# Altium project eLFLv2_0.PrjPcb
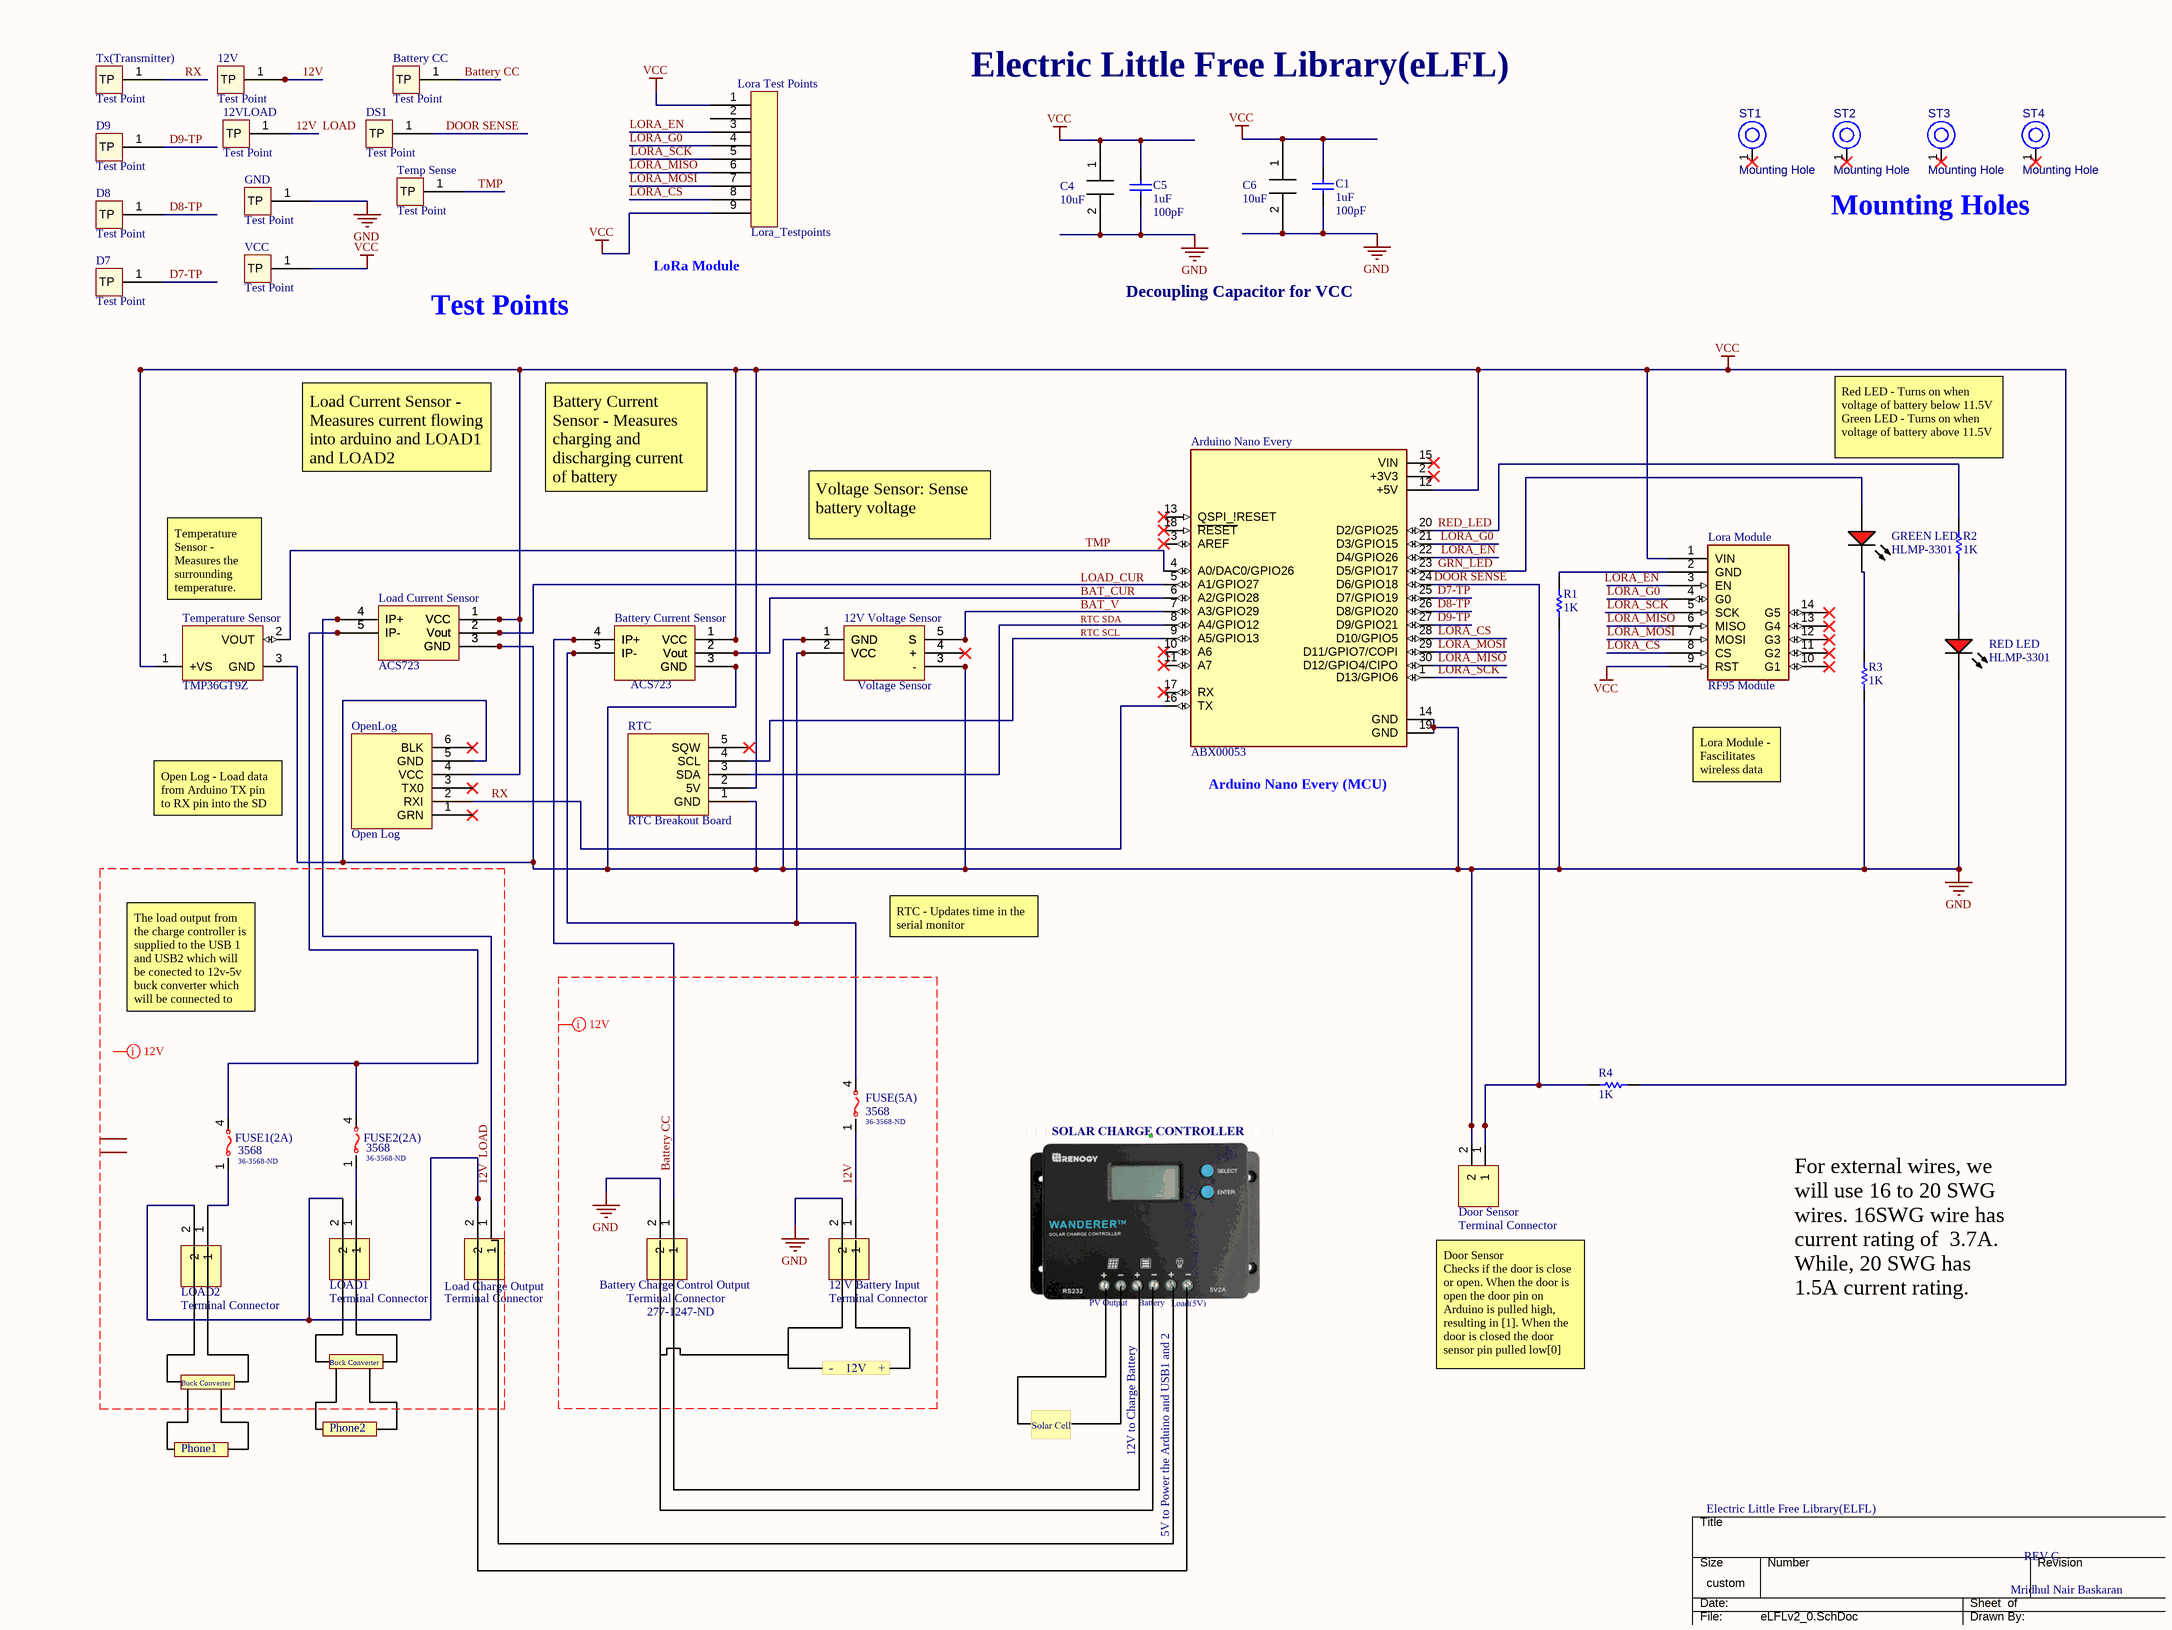
[diagram p0: eLFLv2_0.SchDoc]
1 sheet, 43 parts. Net scope: global (net labels, ports and power ports of the same name join across sheets).
Board file: eLFLv2_0.PcbDoc

## Sheet eLFLv2_0.SchDoc: ELFL REV C
size 406 x 304 mm; ApprovedBy: Professor Giri Venkataramanan; Author: Mridhul Nair; CompanyName: WEMPEC; DrawnBy: Mridhul Nair; Engineer: Mridhul Nair; Address1: mbaskaran@wisc.edu; Revision: B; SheetNumber: 1; SheetTotal: 1

### Parts
12_V_Battery_Input  Terminal Connector  [Terminal Block]
12V  Test Point  [TP1]  (no BOM)
12V_Voltage_Sensor  Voltage Sensor  [Voltage Sensor]
12VLOAD  Test Point  [TP1]  (no BOM)
Arduino_Nano_Every  ABX00053  [Arduino Nano Every]
Battery_CC  Test Point  [TP1]  (no BOM)
Battery_Charge_Control_Output  Terminal Connector  Supplier Part Number 1: 277-1247-ND  [Terminal Block]
Battery_Current_Sensor  ACS723  [Current Sensor]
C1  1uF  value 100pF  [RAD-0.3]
C4  10uF  [Capacitor]
C5  1uF  value 100pF  [RAD-0.3]
C6  10uF  [Capacitor]
D7  Test Point  [0.038_Brass Testpoints]  (no BOM)
D8  Test Point  [0.038_Brass Testpoints]  (no BOM)
D9  Test Point  [0.038_Brass Testpoints]  (no BOM)
Door_Sensor  Terminal Connector  [Terminal Block]
DS1  Test Point  [TP1]  (no BOM)
FUSE1(2A)  3568  Supplier Part Number 1: 36-3568-ND  [Fuse]
FUSE2(2A)  3568  Supplier Part Number 1: 36-3568-ND  [Fuse]
FUSE(5A)  3568  Supplier Part Number 1: 36-3568-ND  [Fuse]
GND  Test Point  [0.038_Brass Testpoints]  (no BOM)
GREEN_LED  HLMP-3301  [LED]
LOAD1  Terminal Connector  [Terminal Block]
LOAD2  Terminal Connector  [Terminal Block]
Load_Charge_Output  Terminal Connector  [Terminal Block]
Load_Current_Sensor  ACS723  [Current Sensor]
Lora_Module  RF95 Module  [RF95]
Lora_Test_Points  Lora_Testpoints  [LORA TESTPOINTS]
OpenLog  Open Log  [OpenLog Breakout Board]
R1  value 1K  [AXIAL-0.3]  (hidden comment: Res1)
R2  value 1K  [AXIAL-0.3]  (hidden comment: Res1)
R3  value 1K  [AXIAL-0.3]  (hidden comment: Res1)
R4  value 1K  [AXIAL-0.3]  (hidden comment: Res1)
RED_LED  HLMP-3301  [LED]
RTC  RTC Breakout Board  [RTC Breakout Board]
ST1  Mounting Hole  [PTH-M2D5X5]
ST2  Mounting Hole  [PTH-M2D5X5]
ST3  Mounting Hole  [PTH-M2D5X5]
ST4  Mounting Hole  [PTH-M2D5X5]
Temp_Sense  Test Point  [TP1]  (no BOM)
Temperature_Sensor  TMP36GT9Z  [HDR1X3]
Tx(Transmitter)  Test Point  [TP1]  (no BOM)
VCC  Test Point  [0.038_Brass Testpoints]  (no BOM)

### Nets
GND: 12_V_Battery_Input.2 12V_Voltage_Sensor.1(GND) 12V_Voltage_Sensor.3(-) Arduino_Nano_Every.14(GND) Arduino_Nano_Every.19(GND) Battery_Charge_Control_Output.2 Battery_Current_Sensor.3(GND) C1.1 C4.2(-) C5.1 C6.2(-) Door_Sensor.2 GND.1(TP) Load_Current_Sensor.3(GND) OpenLog.5(GND) R1.2 R3.2 RED_LED.2(K) RTC.1(GND) Temperature_Sensor.3(GND)
VCC: Arduino_Nano_Every.12(+5V) Battery_Current_Sensor.1(VCC) C1.2 C4.1(+) C5.2 C6.1(+) Load_Current_Sensor.1(VCC) Lora_Module.1(VIN) Lora_Module.9(RST) Lora_Test_Points.1 Lora_Test_Points.9 OpenLog.4(VCC) R4.2 RTC.2(5V) Temperature_Sensor.1(+VS) VCC.1(TP)
12V: 12_V_Battery_Input.1 12V.1(TP) FUSE(5A).1
12V  LOAD: 12VLOAD.1(TP) Load_Charge_Output.1 Load_Current_Sensor.4(IP+)
Battery CC: Battery_CC.1(TP) Battery_Charge_Control_Output.1 Battery_Current_Sensor.4(IP+)
D7-TP: Arduino_Nano_Every.25(D7/GPIO19) D7.1(TP)
D8-TP: Arduino_Nano_Every.26(D8/GPIO20) D8.1(TP)
D9-TP: Arduino_Nano_Every.27(D9/GPIO21) D9.1(TP)
DOOR SENSE: Arduino_Nano_Every.24(D6/GPIO18) Door_Sensor.1 DS1.1(TP) R4.1
GRN_LED: Arduino_Nano_Every.23(D5/GPIO17) GREEN_LED.1(A)
LORA_CS: Arduino_Nano_Every.28(D10/GPIO5) Lora_Module.8(CS) Lora_Test_Points.8
LORA_EN: Arduino_Nano_Every.22(D4/GPIO26) Lora_Module.3(EN) Lora_Test_Points.3
LORA_G0: Arduino_Nano_Every.21(D3/GPIO15) Lora_Module.4(G0) Lora_Test_Points.4
LORA_MISO: Arduino_Nano_Every.30(D12/GPIO4/CIPO) Lora_Module.6(MISO) Lora_Test_Points.6
LORA_MOSI: Arduino_Nano_Every.29(D11/GPIO7/COPI) Lora_Module.7(MOSI) Lora_Test_Points.7
LORA_SCK: Arduino_Nano_Every.1(D13/GPIO6) Lora_Module.5(SCK) Lora_Test_Points.5
RED_LED: Arduino_Nano_Every.20(D2/GPIO25) R2.2
RX: Arduino_Nano_Every.16(TX) OpenLog.2(RXI) Tx(Transmitter).1(TP)
TMP: Arduino_Nano_Every.4(A0/DAC0/GPIO26) Temp_Sense.1(TP) Temperature_Sensor.2(VOUT)
Net12V_Voltage_Sensor_2: 12V_Voltage_Sensor.2(VCC) Battery_Current_Sensor.5(IP-) FUSE(5A).4
Net12V_Voltage_Sensor_5: 12V_Voltage_Sensor.5(S) Arduino_Nano_Every.7(A3/GPIO29)
NetArduino_Nano_Every_5: Arduino_Nano_Every.5(A1/GPIO27) Load_Current_Sensor.2(Vout)
NetArduino_Nano_Every_6: Arduino_Nano_Every.6(A2/GPIO28) Battery_Current_Sensor.2(Vout)
NetArduino_Nano_Every_8: Arduino_Nano_Every.8(A4/GPIO12) RTC.3(SDA)
NetArduino_Nano_Every_9: Arduino_Nano_Every.9(A5/GPIO13) RTC.4(SCL)
NetFUSE1(2A)_4: FUSE1(2A).4 FUSE2(2A).4 Load_Current_Sensor.5(IP-)
NetFUSE1(2A)_ 1: FUSE1(2A).1 LOAD2.1
NetFUSE2(2A)_ 1: FUSE2(2A).1 LOAD1.1
NetGREEN_LED_2: GREEN_LED.2(K) R3.1
NetLOAD1_2: LOAD1.2 LOAD2.2 Load_Charge_Output.2
NetLora_Module_2: Lora_Module.2(GND) R1.1
NetR2_1: R2.1 RED_LED.1(A)

Not connected (* = marked no-connect by the designer): 12V_Voltage_Sensor 4(+)*; Arduino_Nano_Every 2(+3V3)* 3(AREF)* 10(A6)* 11(A7)* 13(QSPI_!RESET)* 15(VIN)* 17(RX)* 18(~{RESET})*; Lora_Module 10(G1)* 11(G2)* 12(G3)* 13(G4)* 14(G5)*; Lora_Test_Points 2; OpenLog 1(GRN)* 3(TX0)* 6(BLK)*; RTC 5(SQW)*; ST1 1(H1)*; ST2 1(H1)*; ST3 1(H1)*; ST4 1(H1)*

### Layout directives
mark named 12V: 12V, 12V  LOAD, Battery CC, GND

### Notes on the sheet
- Electric Little Free Library(eLFL)
- Mounting Holes
- (near Lora_Test_Points) LoRa Module
- Decoupling Capacitor for VCC
- Test Points
- Load Current Sensor - Measures current flowing into arduino and LOAD1 and LOAD2
- Battery Current Sensor - Measures charging and discharging current of battery
- Red LED - Turns on when voltage of battery below 11.5V
  Green LED - Turns on when voltage of battery above 11.5V
- Voltage Sensor: Sense battery voltage
- (near Temperature_Sensor) Temperature Sensor - Measures the surrounding  temperature.
- Open Log - Load data from Arduino TX pin to RX pin into the SD Card
- (near Arduino_Nano_Every) Arduino Nano Every (MCU)
- Lora Module - Fascilitates wireless data transmission
- RTC - Updates time in the serial monitor
- The load output from the charge controller is supplied to the USB 1 and USB2 which will be conected to 12v-5v buck converter which will be connected to phone. The fuses are rated for 2A.
- For external wires, we will use 16 to 20 SWG wires. 16SWG wire has current rating of  3.7A. While, 20 SWG has 1.5A current rating.
- Buck Converter
- Door Sensor
  Checks if the door is close or open. When the door is open the door pin on Arduino is pulled high, resulting in [1]. When the door is closed the door sensor pin pulled low[0]
- Phone2
- Phone1
- 12V to Charge Battery
- Electric Little Free Library(ELFL)
- 5V to Power the Arduino and USB1 and 2
- REV C
- Mridhul Nair Baskaran
- Labels drawn without touching a wire or pin: BAT_CUR, BAT_V, LOAD_CUR

### Library data of the parts
12_V_Battery_Input Battery_Charge_Control_Output Door_Sensor LOAD1 LOAD2 Load_Charge_Output = 1729128: Barrier Strip Terminal Block, 13.5A, 1.5mm2, 1 Row(s), 1 Deck(s); Manufacturer: Phoenix Contact; Fastening Method: SCREW; Number of Decks: 1; Number of Ways: 2; Voltage Rating: 400V; Wire/Cable Gauge: 16AWG; Safety Approval: CSA,CUL,CB,EAC; Supplier 1: Digi-Key; Manufacturer Part Number: 1729128; RoHS: Yes; Category: Terminal Blocks; Stock 1: 54422; Pricing 1: 1=1.21000, 10=1.16200, 50=1.11100, 100=1.08070, 250=1.01000, 500=0.92920, 1000=0.85850, 2500=0.81810, 5000=0.77770 (USD); Mount: Board; Terminal and Terminal Block Type: BARRIER STRIP TERMINAL BLOCK; Number of Rows: 1; Current Rating: 13.5A; Wire Cross Section: 1.5mm2; RoHS Compliant: Yes; REACH SVHC: No SVHC; ComponentLink1URL: https://datasheet.ciiva.com:443/pdfs/VipMasterIC/IC/PCON/PCON-S-A0008047989/PCON-S-A0008036843-1.pdf?src-supplier=IHS+Markit; ComponentLink1Description: https://datasheet.ciiva.com:443/pdfs/VipMasterIC/IC/PCON/PCON-S-A0008047989/PCON-S-A0008036843-1.pdf?src-supplier=IHS+Markit; ComponentLink2URL: https://datasheet.ciiva.com/16046/1729128-16046181.pdf?src-supplier=Onlinecomponents.com; ComponentLink2Description: https://datasheet.ciiva.com/16046/1729128-16046181.pdf?src-supplier=Onlinecomponents.com; ComponentLink3URL: https://datasheet.ciiva.com/15169/getdatasheetpartid-199310-15169845.pdf?src-supplier=Verical; ComponentLink3Description: https://datasheet.ciiva.com/15169/getdatasheetpartid-199310-15169845.pdf?src-supplier=Verical; ComponentLink4URL: https://datasheet.ciiva.com/823/1729128-823779.pdf?src-supplier=Digi-Key; ComponentLink4Description: https://datasheet.ciiva.com/823/1729128-823779.pdf?src-supplier=Digi-Key; ComponentLink5URL: https://datasheet.ciiva.com/14607/70054405-14607157.pdf?src-supplier=Allied+Electronics; ComponentLink5Description: https://datasheet.ciiva.com/14607/70054405-14607157.pdf?src-supplier=Allied+Electronics; ComponentLink6URL: https://datasheet.ciiva.com/29218/743664-da-01-en-printklemmenblock-mkdsn-1-5-2-5-08-29218154.pdf?src-supplier=Conrad; ComponentLink6Description: https://datasheet.ciiva.com/29218/743664-da-01-en-printklemmenblock-mkdsn-1-5-2-5-08-29218154.pdf?src-supplier=Conrad
  12_V_Battery_Input Door_Sensor LOAD1 LOAD2 Load_Charge_Output: Supplier Part Number 1: 277-1247-ND
12V 12VLOAD Battery_CC D7-D9 DS1 GND Temp_Sense Tx(Transmitter) VCC = Testpoint
12V_Voltage_Sensor = Voltage Sense: Header, 5-pin
Arduino_Nano_Every = ABX00053: ARDUINO NANO RP2040 CONNECT WITH; MF: {'manufacturer': u'Arduino'}; Package: None; Value: *; MP: ABX00053; Availability: Unavailable; Price: None
Battery_Current_Sensor Load_Current_Sensor = Current Sense: Header, 5-pin
C1 C5 = Cap: Capacitor; Published: 8-Jun-2000; LatestRevisionDate: 17-Jul-2002; LatestRevisionNote: Re-released for DXP Platform.; PackageReference: RAD-0.3; Publisher: Altium Limited; PackageDescription: Radial Cap, Thru-Hole; 2 Leads; 0.3 in Pin Spacing
C4 C6 = 106CKS450MLU: Aluminum Electrolytic Capacitor, Polarized, Aluminum (wet), 450V, 20% +Tol, 20% -Tol, 10uF, Through Hole Mount; Manufacturer: CDE Illinois Capacitor; Supplier 1: Digi-Key; Manufacturer Part Number: 106CKS450MLU; RoHS: Yes; Category: Aluminum Electrolytic Capacitors; ComponentLink1URL: https://datasheet.ciiva.com/16322/ckr-cksseries-16322639.pdf?src-supplier=Future+Electronics; ComponentLink1Description: https://datasheet.ciiva.com/16322/ckr-cksseries-16322639.pdf?src-supplier=Future+Electronics; Supplier Part Number 1: 106CKS450MLU-ND
FUSE1(2A) FUSE2(2A) FUSE(5A) = 3568: Fuses/Accessories; Manufacturer: Keystone Electronics; Supplier 1: Digi-Key; Manufacturer Part Number: 3568; RoHS: Yes; Category: Fuse Holders; Stock 1: 22984; Pricing 1: 1=1.33000, 25=1.10240, 100=1.01060, 250=0.91868, 500=0.82682, 1000=0.73496, 2500=0.66606, 5000=0.64309 (USD); ComponentLink1URL: https://datasheet.ciiva.com:443/pdfs/VipMasterIC/IC/KEYC/KEYC-S-A0001230927/KEYC-S-A0001230927-1.pdf?src-supplier=IHS+Markit; ComponentLink1Description: https://datasheet.ciiva.com:443/pdfs/VipMasterIC/IC/KEYC/KEYC-S-A0001230927/KEYC-S-A0001230927-1.pdf?src-supplier=IHS+Markit; ComponentLink2URL: https://datasheet.ciiva.com/16294/m60-2p40-16294706.pdf?src-supplier=Future+Electronics; ComponentLink2Description: https://datasheet.ciiva.com/16294/m60-2p40-16294706.pdf?src-supplier=Future+Electronics; ComponentLink3URL: https://datasheet.ciiva.com/16874/70182101-16874378.pdf?src-supplier=Allied+Electronics; ComponentLink3Description: https://datasheet.ciiva.com/16874/70182101-16874378.pdf?src-supplier=Allied+Electronics
GREEN_LED RED_LED = CMP-2000-06411-1: T-1 3/4 (5 mm) Diffused LED Lamp, 1.9 V, -40 to 100 degC, 2-Pin THD, RoHS, Bulk; Manufacturer: Broadcom Avago; Forward Current: 25mA; Forward Voltage: 2.4V; Peak Wavelength: 635nm; Shape Type: Circular; High Brightness: No; Main Category: StandardLED; Test Current (It): 10mA; Dominant Wave Length: 626nm; Number of  Elements: 1; Reverse Voltage: 5V; Chip Material: GaP; Product Height (mm): 9.19mm; Lens Type: ColoredDiffused; Viewing Angle: 60deg; Emitting Color: Red; Luminous Intensity: 5.4mcd; Power Dissipation: 85W; DELETED: Compliant; Product Depth (mm): 6.1mm; Package Description: 2-Pin Through Hole LED, Dia 5.85 mm; Mounting Technology: ThroughHole; Manufacturer URL: http://www.avagotech.com/; Package Type: T-13/4; Operating Temp Range: -40Cto100C; Datasheet URL: http://www.avagotech.com/docs/AV02-1558EN; Mounting: ThroughHole; Lens Dimensions: 5.08x5.08x8.3mm; Package Reference: HLMP-3301; Datasheet Version: 03/2015; Pin Count: 2; Packaging: TapeandReel; Type: Uni-Color; Operating Temperature Classification: Industrial; Lum Intensity: 5.4mcd; Rad Hardened: No; Product Length (mm): 6.1mm; Manufacturer Part Number: HLMP-3301
Lora_Test_Points = Lora_Testpoints: This act as testing point for 9 pin header on Lora for ELFL projects
R1-R4 = Res1: Resistor; Published: 8-Jun-2000; LatestRevisionDate: 17-Jul-2002; LatestRevisionNote: Re-released for DXP Platform.; PackageReference: AXIAL-0.3; Publisher: Altium Limited; PackageDescription: Axial Device, Thru-Hole; 2 Leads; 0.3 in Pin Spacing
ST1-ST4 = CMP-00028-00004-2: M2 PTH (2.5mm), 5mm pad; Pins: 1
Temperature_Sensor = ADI-TMP3X-T-3: Low Voltage Temperature Sensor, 2.7 to 5.5 V Supply, Industrial, 3-pin TO92 (T-3), Tray; Manufacturer: Analog Devices; ComponentLink2Description: Datasheet; PackageReference: T-3; Packing: Tray; ComponentLink2URL: http://www.analog.com/static/imported-files/data_sheets/TMP35_36_37.pdf; ComponentLink4Description: Product URL; ComponentLink3Description: Package Specification; Code_JEDEC: TO-226-AA; PartNumber: TMP36GT9Z; PackageDescription: 3-Pin Plastic Header-Style Package, 1.27 mm Pitch; PackageVersion: 042208-A, 04/2008; ComponentLink3URL: http://www.analog.com/static/imported-files/packages/PKG_PDF/TO-92(T)/T_3.pdf; ComponentLink1Description: Manufacturer URL; Supply Voltage Range: 2.7 to 5.5 V; Mounting Technology: Through Hole; DatasheetVersion: Rev. F; ComponentLink4URL: http://www.analog.com/en/mems-sensors/digital-temperature-sensors/tmp36/products/product.html; ComponentLink1URL: http://www.analog.com/en/index.html